# Altium schematic sheet controller_8266_psu.SchDoc: CONTROLLER_ESP8266_PSU
size A4; DocumentNumber: 2; SheetNumber: 2; SheetTotal: 3
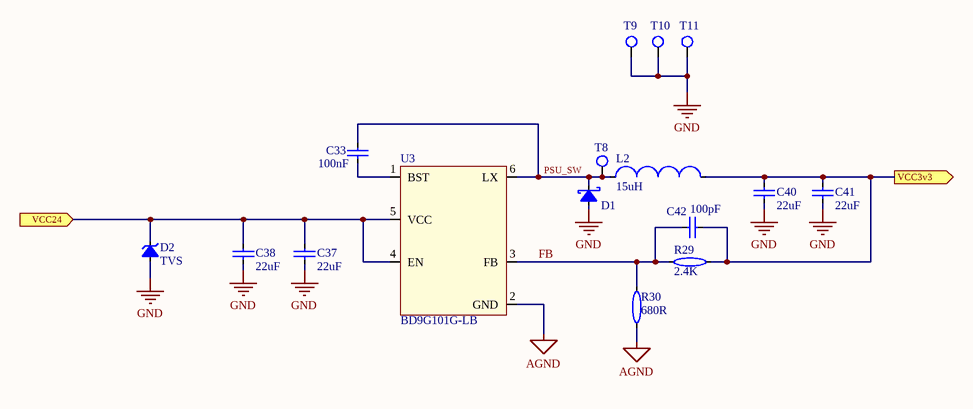
[diagram p0: controller_8266_psu.SchDoc]

## Parts
C33  value 100nF  [CAPC_0603_1608X08L]  (hidden comment: Cap)
C37  value 22uF  [CAPC_1206_3216X16L]  (hidden comment: Cap)
C38  value 22uF  [CAPC_1206_3216X16L]  (hidden comment: Cap)
C40  value 22uF  [CAPC_1206_3216X16L]  (hidden comment: Cap)
C41  value 22uF  [CAPC_1206_3216X16L]  (hidden comment: Cap)
C42  value 100pF  [CAPC_0603_1608X08L]  (hidden comment: Cap)
D1  Schottky 40V 3A  [SOD123]  (value not drawn)
D2  TVS  [SODFL350X120-2L]
L2  value 15uH  [INDP4949X30N]  (hidden comment: Inductor)
R29  value 2.4K  [RESC_0603_1608X08L]  (hidden comment: Res2)
R30  value 680R  [RESC_0603_1608X08L]  (hidden comment: Res2)
T8  Testpoint  [TESTPOINT]  (value not drawn)  (no BOM)
T9  Testpoint  [TESTPOINT]  (value not drawn)  (no BOM)
T10  Testpoint  [TESTPOINT]  (value not drawn)  (no BOM)
T11  Testpoint  [TESTPOINT]  (value not drawn)  (no BOM)
U3  BD9G101G-LB  [TSOP95P280X125-6L]

## Ports
VCC3v3 (out), VCC24 (in)

## Nets
AGND: R30.2 U3.2(GND)
GND: C37.1 C38.1 C40.1 C41.1 D1.1(A) D2.1(A) T9.1(VOUT) T10.1(VOUT) T11.1(VOUT)
FB: C42.1 R29.2 R30.1 U3.3(FB)
PSU_SW: C33.2 D1.2(K) L2.1 T8.1(VOUT) U3.6(LX)
VCC3v3: C40.2 C41.2 C42.2 L2.2 R29.1 ; port VCC3v3
VCC24: C37.2 C38.2 D2.2(K) U3.4(EN) U3.5(VCC) ; port VCC24
NetC33_1: C33.1 U3.1(BST)

## Library data of the parts
C33 C37 C38 C40-C42 = Cap: Capacitor; Published: 8-Jun-2000; LatestRevisionDate: 17-Jul-2002; LatestRevisionNote: Re-released for DXP Platform.; PackageReference: RAD-0.3; Publisher: Altium Limited; PackageDescription: Radial Cap, Thru-Hole; 2 Leads; 0.3 in Pin Spacing
D1 = D Schottky: Schottky Diode; Published: 8-Jun-2000; LatestRevisionDate: 17-Jul-2002; LatestRevisionNote: Re-released for DXP Platform.; PackageReference: SMB; Publisher: Altium Limited; PackageDescription: DO-214-AA/SMB; 2 C-Bend Leads; Body 5.3 x 3.6 mm, inc. leads (LxW); Code_JEDEC: DO-214-AA
D2 = D Zener: Schottky Diode; Manufacturer Part Number: SMBJ24CA; Manufacturer: Littelfuse; Published: 8-Jun-2000; LatestRevisionDate: 17-Jul-2002; LatestRevisionNote: Re-released for DXP Platform.; PackageReference: SMB; Publisher: Altium Limited; PackageDescription: DO-214-AA/SMB; 2 C-Bend Leads; Body 5.3 x 3.6 mm, inc. leads (LxW); Code_JEDEC: DO-214-AA; Vz: *
L2 = Inductor: Code_IEC: 1005; Published: 8-Jun-2000; LatestRevisionDate: 29-May-2009; LatestRevisionNote: IPC-7351 Footprint Added.; PackageReference: 0402-A; Publisher: Altium Limited; PackageDescription: Chip Inductor; Code_JEITA: 0402
R29 R30 = Res2: Resistor; Published: 8-Jun-2000; LatestRevisionDate: 17-Jul-2002; LatestRevisionNote: Re-released for DXP Platform.; PackageReference: AXIAL-0.4; Publisher: Altium Limited; PackageDescription: Axial Device, Thru-Hole; 2 Leads; 0.4 in Pin Spacing
U3 = BD9G102G-LB